# EAGLE schematic avr_hcsr04 (EAGLE 7.5.0)
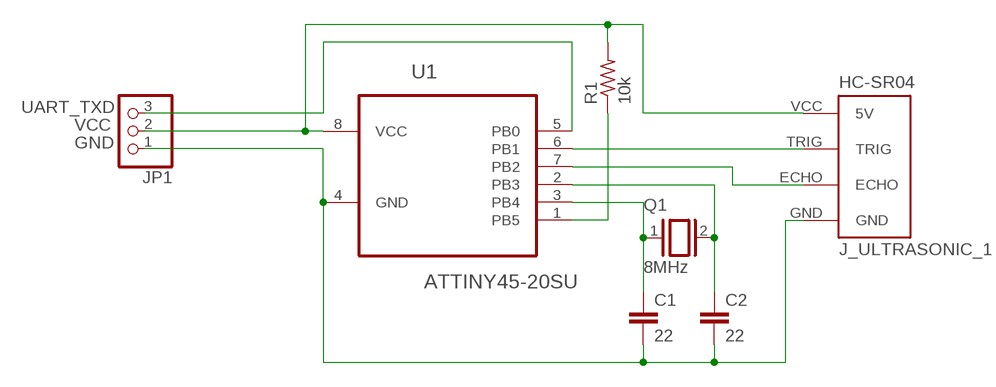
[diagram p0: schematic, sheet 1]

## Parts
C1  22  C-EU025-024X044  [C025-024X044]
C2  22  C-EU025-024X044  [C025-024X044]
J_ULTRASONIC_1  HC-SR04  [HC-SR04_FOOTPRINT]
JP1  PINHD-1X3  [1X03]
Q1  8MHz  XTAL  [Q]
R1  10k  R-US_0204/7  [0204/7]
U1  ATTINY45-20SU  [SOIC127P798X216-8N]

## Nets
GND: C1.2 C2.2 J_ULTRASONIC_1.GND JP1.1 U1.4(GND)
N$1: R1.1 U1.1(PB5)
N$2: J_ULTRASONIC_1.ECHO U1.7(PB2)
N$3: C2.1 Q1.2 U1.2(PB3)
N$4: C1.1 Q1.1 U1.3(PB4)
N$5: J_ULTRASONIC_1.TRIG U1.6(PB1)
UART_TXD: JP1.3 U1.5(PB0)
VCC: J_ULTRASONIC_1.VCC(5V) JP1.2 R1.2 U1.8(VCC)

## Library data of the parts
C1 C2 = rcl:C-EU: CAPACITOR, European symbol
J_ULTRASONIC_1 = hc-sr04:HC-SR04: Ultrasonic Sensor HC-SR04
JP1 = pinhead:PINHD-1X3: PIN HEADER
Q1 = special:XTAL: CRYSTAL
R1 = rcl:R-US_: RESISTOR, American symbol
U1 = Atmel_By_element14_Batch_1-00:ATTINY45-20SU: 8-bit Microcontroller with 4 Bytes In-System Programmable Flash; MPN: ATTINY45-20SU; OC_FARNELL: 1288353; OC_NEWARK: 23M5073; PACKAGE: SOIC-8; SUPPLIER: Atmel